# EAGLE design module (EAGLE 9.5.0)

## Sheet 1 of 2
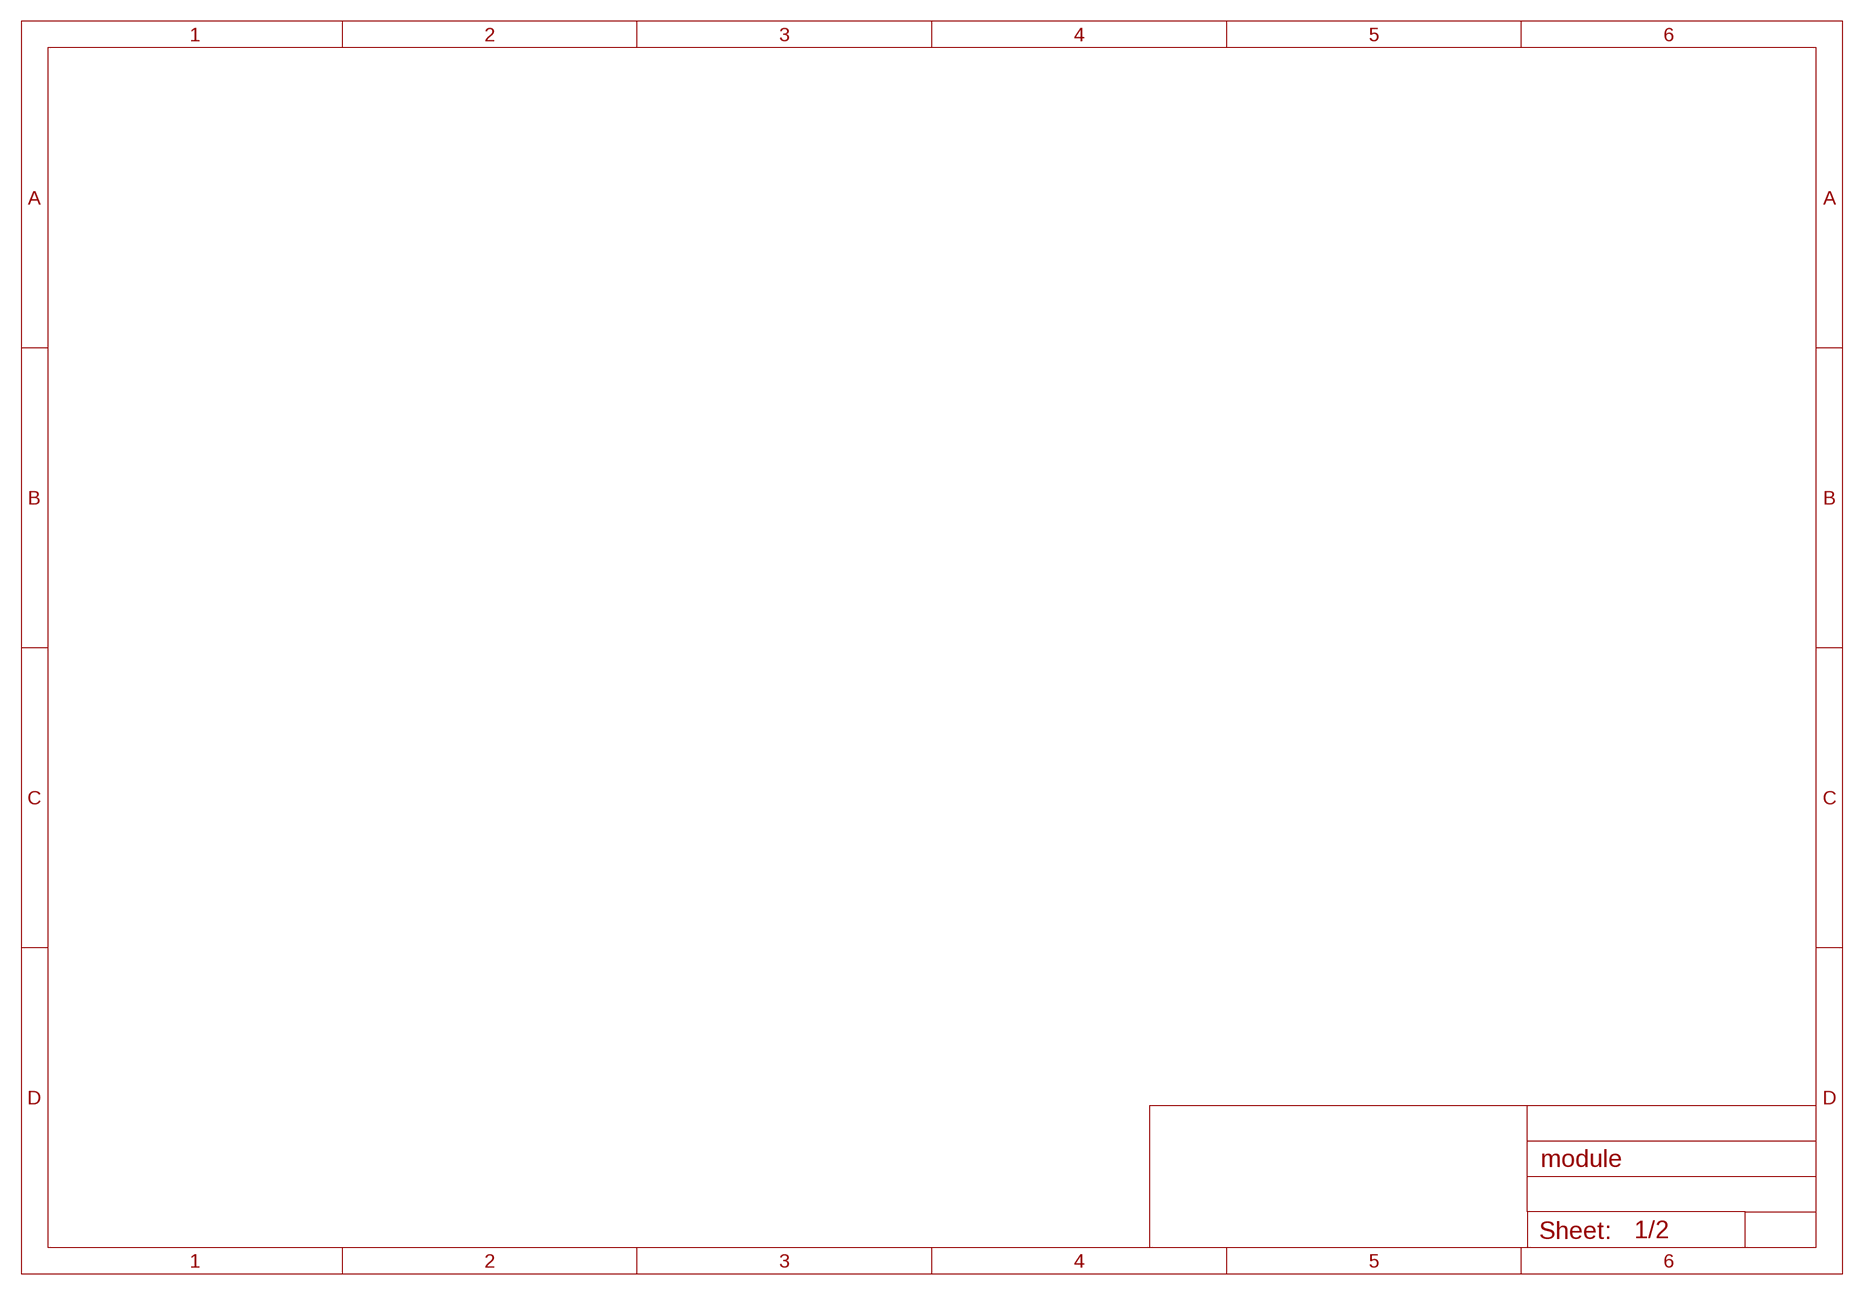
[diagram p0: schematic, sheet 1]

## Sheet 2 of 2
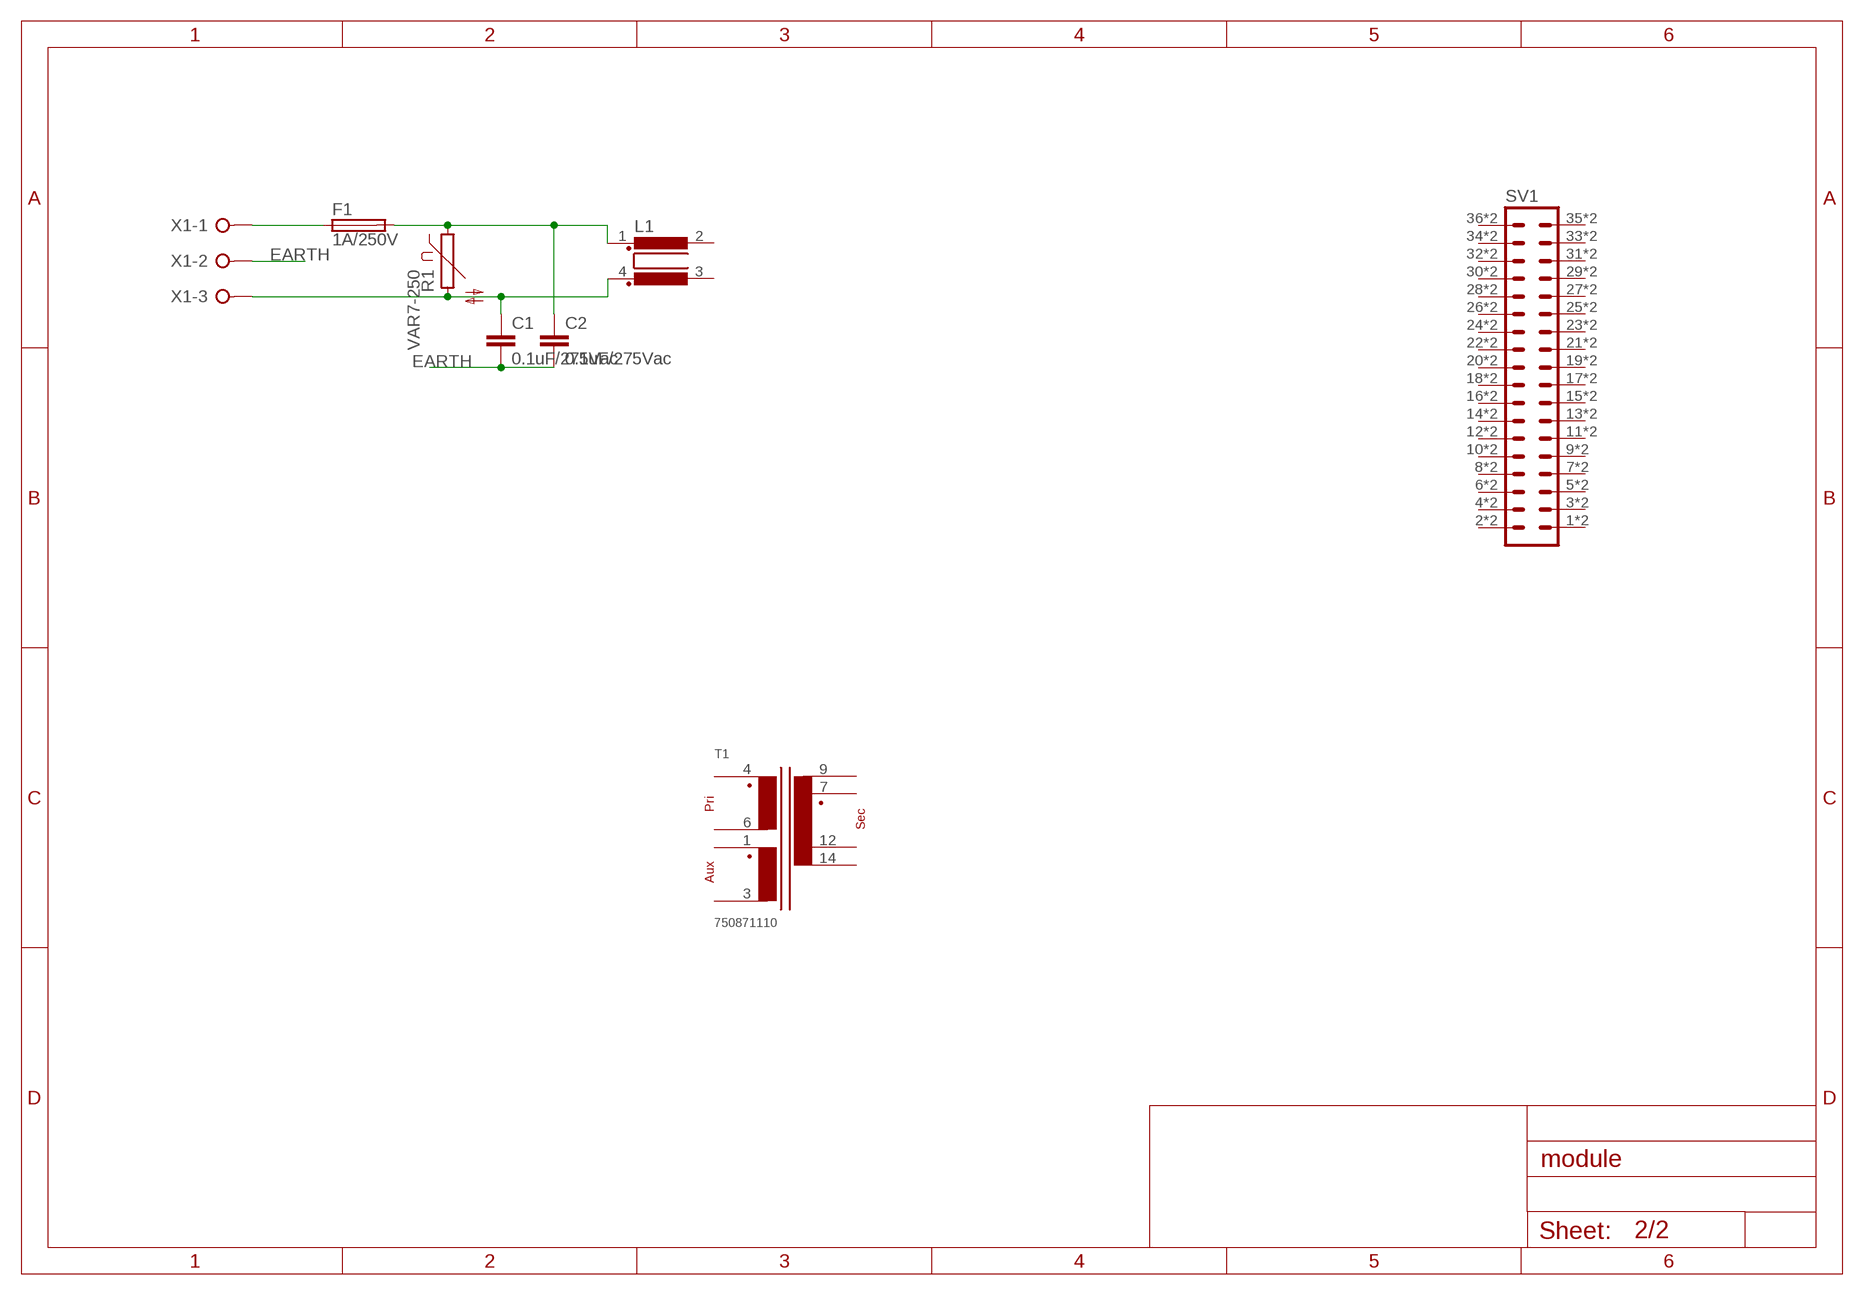
[diagram p1: schematic, sheet 2]

### Parts
C1  0.1uF/275Vac  C-EU102-064X133  [C102-064X133]
C2  0.1uF/275Vac  C-EU102-064X133  [C102-064X133]
F1  1A/250V  ZH8  [ZH8X2]
L1  SSR7HS-M11064  [SSRH7HS-M]
R1  VAR7-250  S05K250  [S05K250]
SV1  MA18-2SMT  [MA18-2-SMT]
T1  750871110  [EE20/9/11_THT_H_14PIN_EXT_(5443)]
X1  W237-03P  [W237-133]

### Nets
EARTH [hv]: C1.2 C2.2 X1.2
N$1 [hv]: F1.1 F1.1A X1.1
N$2 [hv]: C1.1 L1.4 R1.2 X1.3
N$3: C2.1 F1.2 F1.2A L1.1 R1.1
Unconnected: L1.2 L1.3 SV1.1 SV1.2 SV1.3 SV1.4 SV1.5 SV1.6 SV1.7 SV1.8 SV1.9 SV1.10 SV1.11 SV1.12 SV1.13 SV1.14 SV1.15 SV1.16 SV1.17 SV1.18 SV1.19 SV1.20 SV1.21 SV1.22 SV1.23 SV1.24 SV1.25 SV1.26 SV1.27 SV1.28 SV1.29 SV1.30 SV1.31 SV1.32 SV1.33 SV1.34 SV1.35 SV1.36 SV1.P$1 SV1.P$2 SV1.P$3 SV1.P$4 SV1.P$5 SV1.P$6 SV1.P$7 SV1.P$8 SV1.P$9 SV1.P$10 SV1.P$11 SV1.P$12 SV1.P$13 SV1.P$14 SV1.P$15 SV1.P$16 SV1.P$17 SV1.P$18 SV1.P$19 SV1.P$20 SV1.P$21 SV1.P$22 SV1.P$23 SV1.P$24 SV1.P$25 SV1.P$26 SV1.P$27 SV1.P$28 SV1.P$29 SV1.P$30 SV1.P$31 SV1.P$32 SV1.P$33 SV1.P$34 SV1.P$35 SV1.P$36 T1.1 T1.3 T1.4 T1.6 T1.7 T1.9 T1.12 T1.14

## Library data of the parts
C1 C2 = rcl:C-EU: CAPACITOR, European symbol; SPICEPREFIX: C
F1 = parts-profuse:ZH8: there are two zh8 holders used
L1 = parts-kemet:SSR7HS-M
R1 = parts-srpassives:S05K250: VARISTOR
SV1 = parts-passives:MA18-2: PIN HEADER
T1 = parts-wurth:750871110: Package Style: EE20/9/11 Mounting: THT Pins: 14 pins Bobbin: 070-5443 Best pinouts for production vary per application. Please contact Wurth Electronics Midcom, Inc. for assistance with your custom design. Website: Wurth Electronics Midcom <http://www.we-online.com/midcom> Contact us Wurth Electronics Midcom, Inc. 121 Airport Dr. Watertown, SD 57201 Phone: (605) 886-4385 Fax: (605) 886-4486 E-Mail: midcom@we-online.com; AVAILABILITY: Unavailable; DESCRIPTION: Trans Off Line Power St Viper28; MF: Wurth Electronics; MP: 750871110; PACKAGE: MSOP-10 Würth Elektronik; PRICE: None
X1 = con-wago-508:W237-03P: WAGO SREW CLAMP; OC_FARNELL: unknown; OC_NEWARK: unknown

## Net classes
1 hv: width 1 mm, drill 0.6 mm, clearance 3 mm to class 0, clearance 3 mm

## Board
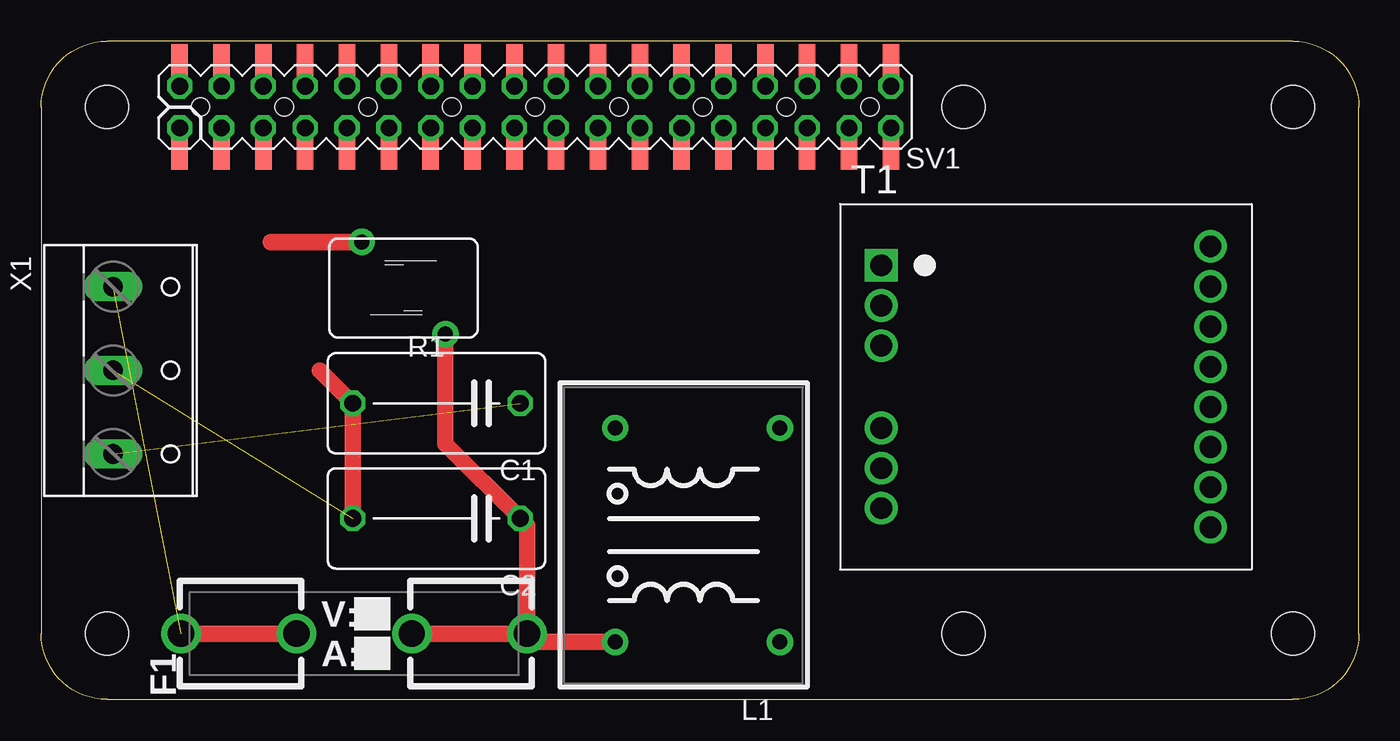
[diagram p2: board, top side]
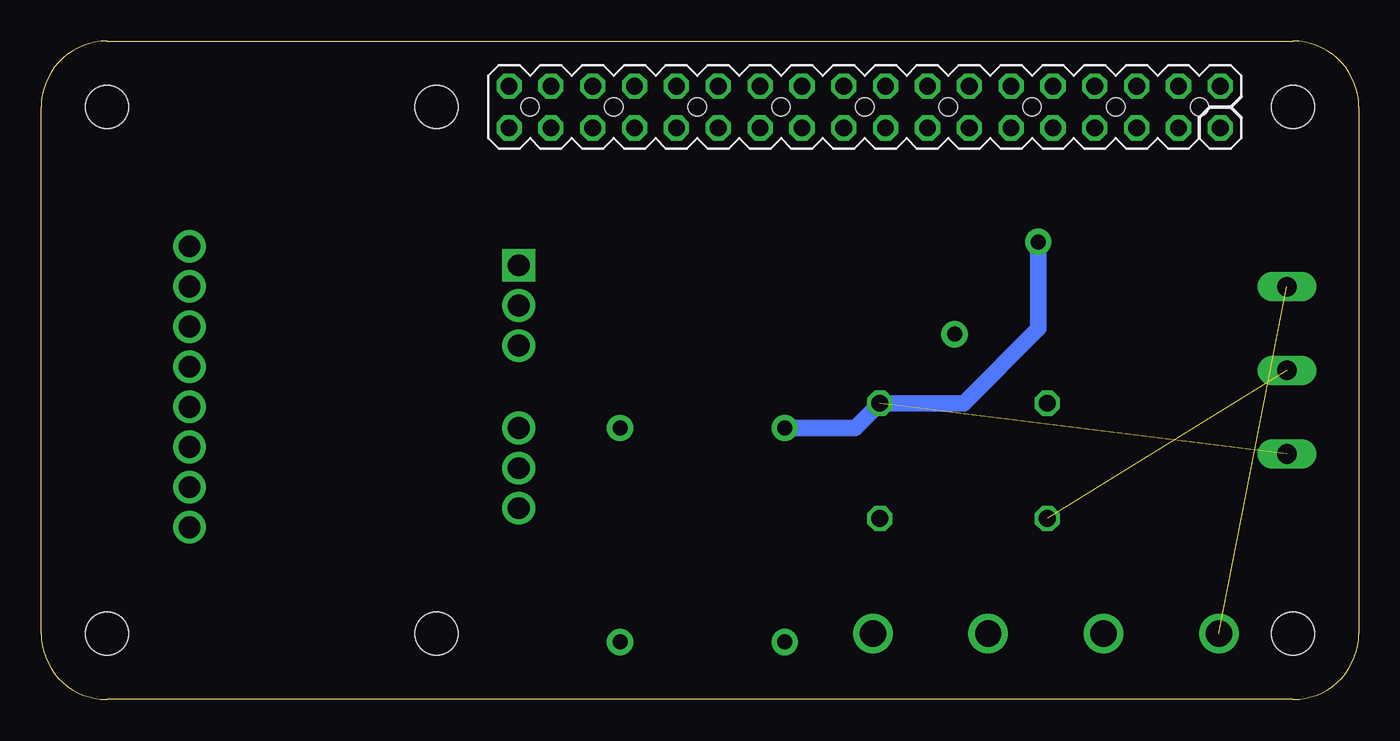
[diagram p3: board, bottom side, seen from below]

Size 80 x 40 mm. Coordinates in mm from the lower left corner, seen from the top.
Outline: 4,0 76,0 arc90 80,4 80,36 arc90 76,40 4,40 arc90 0,36 0,4 arc90 4,0
Copper layers (1*16): Top 0.035mm / dielectric 0.93mm / Bottom 0.035mm
Design rules "default *": minimum track width 6mil, minimum drill 0.3mm, track to track 6mil, track to pad 6mil, pad to pad 6mil, via to via 6mil, smd to smd 6mil, copper to edge 0.5mm, drill to drill 6mil, minimum pad ring 10mil, minimum via ring 8mil, stop-mask expansion 4mil, vias tented up to drill 0.6mm, thermal gap 10mil
Holes 2.6 mm at 4,36 56,36 76,36 4,4 56,4 76,4
tRestrict: area 1,33 to 7,39; area 1,1 to 7,7; area 53,1 to 59,7; area 73,1 to 79,7; area 73,33 to 79,39; area 53,33 to 59,39
bRestrict: area 1,33 to 7,39; area 1,1 to 7,7; area 53,1 to 59,7; area 73,1 to 79,7; area 73,33 to 79,39; area 53,33 to 59,39

### Footprints (pad centres in the part's own frame; a part is rotated, then mirrored left to right if it is on the bottom)
C102-064X133 = drill 1.016 octagon: 1 -5.08,0; 2 5.08,0
ZH8X2 = drill 1.6: 1 -10.5,0; 1A -3.5,0; 2 3.5,0; 2A 10.5,0
SSRH7HS-M = drill 0.9 pad 1.6: 1 -6.5,4.15; 2 -6.5,-5.85; 3 6.5,-5.85; 4 6.5,4.15
S05K250 = drill 0.9 pad 1.6: 1 -2.8,-2.54; 2 2.8,2.54
MA18-2-SMT = drill 1.016 pad 1.5 octagon: 1 -21.59,-1.27; 2 -21.59,1.27; 3 -19.05,-1.27; 4 -19.05,1.27; 5 -16.51,-1.27; 6 -16.51,1.27; 7 -13.97,-1.27; 8 -13.97,1.27; 9 -11.43,-1.27; 10 -11.43,1.27; 11 -8.89,-1.27; 12 -8.89,1.27; 13 -6.35,-1.27; 14 -6.35,1.27; 15 -3.81,-1.27; 16 -3.81,1.27; 17 -1.27,-1.27; 18 -1.27,1.27; 19 1.27,-1.27; 20 1.27,1.27; 21 3.81,-1.27; 22 3.81,1.27; 23 6.35,-1.27; 24 6.35,1.27; 25 8.89,-1.27; 26 8.89,1.27; 27 11.43,-1.27; 28 11.43,1.27; 29 13.97,-1.27; 30 13.97,1.27; 31 16.51,-1.27; 32 16.51,1.27; 33 19.05,-1.27; 34 19.05,1.27; 35 21.59,-1.27; 36 21.59,1.27 | smd 1 x 2: P$1 -21.59,-2.8; P$2 -21.59,2.8; P$3 -19.05,-2.8; P$4 -19.05,2.8; P$5 -16.51,-2.8; P$6 -16.51,2.8; P$7 -13.97,-2.8; P$8 -13.97,2.8; P$9 -11.43,-2.8; P$10 -11.43,2.8; P$11 -8.89,-2.8; P$12 -8.89,2.8; P$13 -6.35,-2.8; P$14 -6.35,2.8; P$15 -3.81,-2.8; P$16 -3.81,2.8; P$17 -1.27,-2.8; P$18 -1.27,2.8; P$19 1.27,-2.8; P$20 1.27,2.8; P$21 3.81,-2.8; P$22 3.81,2.8; P$23 6.35,-2.8; P$24 6.35,2.8; P$25 8.89,-2.8; P$26 8.89,2.8; P$27 11.43,-2.8; P$28 11.43,2.8; P$29 13.97,-2.8; P$30 13.97,2.8; P$31 16.51,-2.8; P$32 16.51,2.8; P$33 19.05,-2.8; P$34 19.05,2.8; P$35 21.59,-2.8; P$36 21.59,2.8 | hole 1.1: -20.32,0; -15.24,0; -5.08,0; 0,0; 5.08,0; 20.32,0; -10.16,0; 10.16,0; 15.24,0
EE20/9/11_THT_H_14PIN_EXT_(5443) = drill 1.321 square: 1 -9.995,7.379 | drill 1.321: 2 -9.995,4.94; 3 -9.995,2.502; 4 -9.995,-2.502; 5 -9.995,-4.94; 6 -9.995,-7.379; 7 9.995,-8.534; 8 9.995,-6.096; 9 9.995,-3.658; 10 9.995,-1.219; 11 9.995,1.219; 12 9.995,3.658; 13 9.995,6.096; 14 9.995,8.534
W237-133 = drill 1.194 long: 1 -5.08,-0.635; 2 0,-0.635; 3 5.08,-0.635

### Placement (x,y rotation side)
C1  24,18 180 top
C2  24,11 180 top
F1  19,4 0 top
L1  39,10 90 top
R1  22,25 90 top
SV1  30,36 0 top
T1  61,19 0 top
X1  5,20 270 top

### Tracks (layer width: path | path; a pad name or v marks a point on that pad's centre or on a via)
EARTH  (1 unrouted)
  Top 1: 16.92,20 C1.2 C2.2
N$1  (1 unrouted)
  Top 1: F1.1 F1.1A
N$2  (1 unrouted)
  Top 1: R1.2 13.95,27.8
  Bottom 1: R1.2 19.46,22.54 24,18 C1.1 30.58,16.5 L1.4
N$3
  Top 1: F1.2 F1.2A | R1.1 24.54,15.54 C2.1 29.5,10.58 F1.2A | L1.1 30,3.5 F1.2A